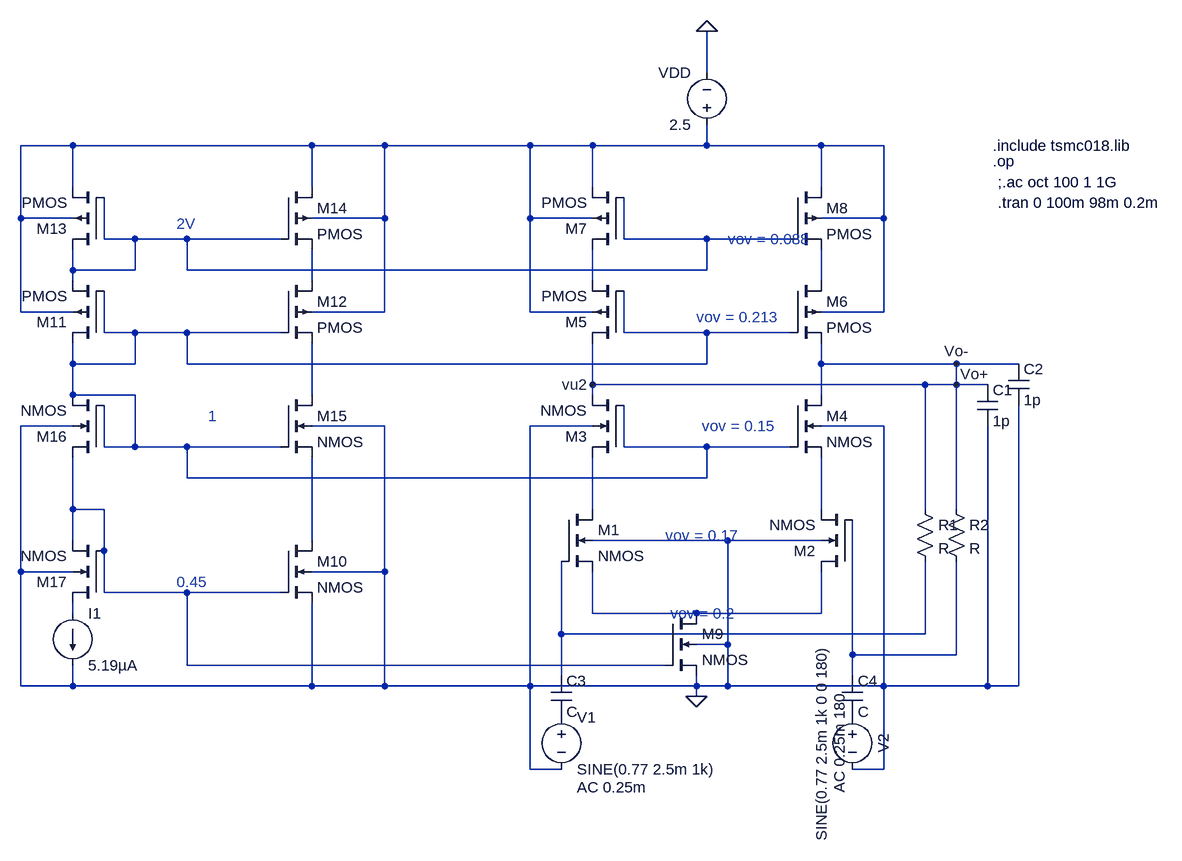
[diagram p0: schematic advdLtspice.asc]
advdLtspice.asc, the LTspice schematic file:
Version 4
SHEET 1 1448 1228
WIRE 720 32 720 -32
WIRE -256 144 -336 144
WIRE 112 144 -256 144
WIRE 224 144 112 144
WIRE 448 144 224 144
WIRE 544 144 448 144
WIRE 720 144 720 112
WIRE 720 144 544 144
WIRE 896 144 720 144
WIRE 992 144 896 144
WIRE -256 208 -256 144
WIRE 112 208 112 144
WIRE 544 208 544 144
WIRE 896 208 896 144
WIRE -336 256 -336 144
WIRE -256 256 -336 256
WIRE 224 256 224 144
WIRE 224 256 112 256
WIRE 448 256 448 144
WIRE 544 256 448 256
WIRE 992 256 992 144
WIRE 992 256 896 256
WIRE -208 288 -208 224
WIRE -160 288 -208 288
WIRE -80 288 -160 288
WIRE 64 288 -80 288
WIRE 592 288 592 224
WIRE 720 288 592 288
WIRE 848 288 720 288
WIRE -256 336 -256 304
WIRE -160 336 -160 288
WIRE -160 336 -256 336
WIRE -80 336 -80 288
WIRE 720 336 720 288
WIRE 720 336 -80 336
WIRE -256 352 -256 336
WIRE 112 352 112 304
WIRE 544 352 544 304
WIRE 896 352 896 304
WIRE -336 400 -336 256
WIRE -256 400 -336 400
WIRE 224 400 224 256
WIRE 224 400 112 400
WIRE 448 400 448 256
WIRE 544 400 448 400
WIRE 992 400 992 256
WIRE 992 400 896 400
WIRE -208 432 -208 368
WIRE -160 432 -208 432
WIRE -80 432 -160 432
WIRE 64 432 -80 432
WIRE 592 432 592 368
WIRE 720 432 592 432
WIRE 848 432 720 432
WIRE -256 480 -256 448
WIRE -160 480 -160 432
WIRE -160 480 -256 480
WIRE -80 480 -80 432
WIRE 720 480 720 432
WIRE 720 480 -80 480
WIRE 896 480 896 448
WIRE 1104 480 896 480
WIRE 1200 480 1104 480
WIRE 544 512 544 448
WIRE 1056 512 544 512
WIRE 1104 512 1104 480
WIRE 1104 512 1056 512
WIRE 1152 512 1104 512
WIRE -256 528 -256 480
WIRE -160 528 -256 528
WIRE 112 528 112 448
WIRE 544 528 544 512
WIRE 896 528 896 480
WIRE -256 576 -336 576
WIRE 224 576 112 576
WIRE 544 576 448 576
WIRE 992 576 896 576
WIRE -208 608 -208 544
WIRE -160 608 -160 528
WIRE -160 608 -208 608
WIRE -80 608 -160 608
WIRE 64 608 -80 608
WIRE 592 608 592 544
WIRE 720 608 592 608
WIRE 848 608 720 608
WIRE -80 656 -80 608
WIRE 720 656 720 608
WIRE 720 656 -80 656
WIRE -256 704 -256 624
WIRE -208 704 -256 704
WIRE 544 704 544 624
WIRE 896 704 896 624
WIRE 1056 704 1056 512
WIRE 1104 704 1104 512
WIRE -256 752 -256 704
WIRE 112 752 112 624
WIRE 752 752 544 752
WIRE 896 752 752 752
WIRE -208 768 -208 704
WIRE -336 800 -336 576
WIRE -256 800 -336 800
WIRE 224 800 224 576
WIRE 224 800 112 800
WIRE -208 832 -208 768
WIRE -80 832 -208 832
WIRE 64 832 -80 832
WIRE -256 864 -256 848
WIRE 544 864 544 800
WIRE 704 864 544 864
WIRE 896 864 896 800
WIRE 896 864 704 864
WIRE 496 896 496 784
WIRE 1056 896 1056 784
WIRE 1056 896 496 896
WIRE 752 912 752 752
WIRE 752 912 704 912
WIRE 944 928 944 720
WIRE 1104 928 1104 784
WIRE 1104 928 944 928
WIRE -80 944 -80 832
WIRE 656 944 -80 944
WIRE 496 960 496 896
WIRE 944 960 944 928
WIRE -336 976 -336 800
WIRE -256 976 -256 944
WIRE -256 976 -336 976
WIRE 112 976 112 848
WIRE 112 976 -256 976
WIRE 224 976 224 800
WIRE 224 976 112 976
WIRE 448 976 448 576
WIRE 448 976 224 976
WIRE 704 976 704 960
WIRE 704 976 448 976
WIRE 752 976 752 912
WIRE 752 976 704 976
WIRE 992 976 992 576
WIRE 992 976 752 976
WIRE 1152 976 1152 576
WIRE 1152 976 992 976
WIRE 1200 976 1200 544
WIRE 1200 976 1152 976
WIRE 704 992 704 976
WIRE 448 1104 448 976
WIRE 496 1104 448 1104
WIRE 992 1104 992 976
WIRE 992 1104 944 1104
FLAG 704 992 0
FLAG 720 -32 0
FLAG 1104 480 Vo-
FLAG 1104 512 Vo+
FLAG 544 512 vu2
SYMBOL cmosn 496 704 R0
SYMATTR InstName M1
SYMATTR Value2 l=0.35u w=1.463u
SYMATTR Value NMOS
SYMBOL cmosn 944 800 R180
SYMATTR InstName M2
SYMATTR Value2 l=0.35u w=1.463u
SYMATTR Value NMOS
SYMBOL cmosn 592 624 R180
SYMATTR InstName M3
SYMATTR Value2 l=0.35u w=10.987u
SYMATTR Value NMOS
SYMBOL cmosn 848 528 R0
SYMATTR InstName M4
SYMATTR Value2 l=0.35u w=10.987u
SYMATTR Value NMOS
SYMBOL cmosp 592 448 R180
SYMATTR InstName M5
SYMATTR Value2 l=0.35u w=12.129u
SYMATTR Value PMOS
SYMBOL cmosp 848 352 R0
SYMATTR InstName M6
SYMATTR Value2 l=0.35u w=12.129u
SYMATTR Value PMOS
SYMBOL cmosp 592 304 R180
SYMATTR InstName M7
SYMATTR Value2 l=0.35u w=0.737u
SYMATTR Value PMOS
SYMBOL cmosp 848 208 R0
SYMATTR InstName M8
SYMATTR Value2 l=0.35u w=0.737u
SYMATTR Value PMOS
SYMBOL cmosn 656 864 R0
SYMATTR InstName M9
SYMATTR Value2 l=0.35u w=3.1814u
SYMATTR Value NMOS
SYMBOL voltage 720 128 R180
WINDOW 0 24 96 Left 2
WINDOW 3 24 16 Left 2
WINDOW 123 0 0 Left 0
WINDOW 39 0 0 Left 0
SYMATTR InstName VDD
SYMATTR Value 2.5
SYMBOL voltage 496 1008 R0
WINDOW 123 24 124 Left 2
WINDOW 39 0 0 Left 0
SYMATTR Value2 AC 0.25m
SYMATTR InstName V1
SYMATTR Value SINE(0.77 2.5m 1k)
SYMBOL voltage 944 1008 R0
WINDOW 0 32 56 VTop 2
WINDOW 3 -32 56 VBottom 2
WINDOW 123 -4 56 VBottom 2
WINDOW 39 0 0 Left 0
SYMATTR InstName V2
SYMATTR Value SINE(0.77 2.5m 1k 0 0 180)
SYMATTR Value2 AC 0.25m 180
SYMBOL pmos4 -208 448 R180
SYMATTR InstName M11
SYMATTR Value2 l=0.35u w=0.35u
SYMBOL pmos4 64 352 R0
SYMATTR InstName M12
SYMATTR Value2 l=0.35u w=0.35u
SYMBOL pmos4 -208 304 R180
SYMATTR InstName M13
SYMATTR Value2 l=0.35u w=15.1289u
SYMBOL pmos4 64 208 R0
SYMATTR InstName M14
SYMATTR Value2 l=0.35u w=15.1289u
SYMBOL nmos4 64 528 R0
SYMATTR InstName M15
SYMATTR Value2 l=0.35u w=34.545u
SYMBOL nmos4 -208 624 R180
SYMATTR InstName M16
SYMATTR Value2 l=0.35u w=34.545u
SYMBOL cap 1136 512 R0
SYMATTR InstName C1
SYMATTR Value 1p
SYMBOL cap 1184 480 R0
SYMATTR InstName C2
SYMATTR Value 1p
SYMBOL nmos4 64 752 R0
SYMATTR InstName M10
SYMATTR Value2 l=0.35u w=24.93u
SYMBOL nmos4 -208 848 R180
SYMATTR InstName M17
SYMATTR Value2 l=0.35u w=24.93u
SYMBOL current -256 864 R0
WINDOW 123 0 0 Left 0
WINDOW 39 0 0 Left 0
SYMATTR InstName I1
SYMATTR Value 5.19µA
SYMBOL cap 480 960 R0
SYMATTR InstName C3
SYMBOL cap 928 960 R0
SYMATTR InstName C4
SYMBOL res 1040 688 R0
SYMATTR InstName R1
SYMBOL res 1088 688 R0
SYMATTR InstName R2
TEXT 1160 144 Left 2 !.include tsmc018.lib
TEXT 1160 168 Left 2 !.op
TEXT 1168 200 Left 2 !;.ac oct 100 1 1G
TEXT -96 816 Left 2 ;0.45
TEXT 656 744 Left 2 ;vov = 0.17
TEXT 664 864 Left 2 ;vov = 0.2
TEXT 712 576 Left 2 ;vov = 0.15
TEXT -48 560 Left 2 ;1
TEXT 704 408 Left 2 ;vov = 0.213
TEXT -96 264 Left 2 ;2V
TEXT 752 288 Left 2 ;vov = 0.088
TEXT 1168 232 Left 2 !.tran 0 100m 98m 0.2m

The netlist it stands for:
* advdLtspice.asc
M1 N009 N014 N013 0 NMOS l=0.35u w=1.463u
M2 N013 N015 N010 0 NMOS l=0.35u w=1.463u
M3 N009 N006 vu2 0 NMOS l=0.35u w=10.987u
M4 vu2 N006 N010 0 NMOS l=0.35u w=10.987u
M5 vu2 N006 N004 N001 PMOS l=0.35u w=12.129u
M6 N005 N006 vu2 N001 PMOS l=0.35u w=12.129u
M7 N004 N002 N001 N001 PMOS l=0.35u w=0.737u
M8 N001 N002 N005 N001 PMOS l=0.35u w=0.737u
M9 N013 N008 0 0 NMOS l=0.35u w=3.1814u
VDD N001 0 2.5
V1 P001 0 SINE(0.77 2.5m 1k) AC 0.25m
V2 P002 0 SINE(0.77 2.5m 1k 0 0 180) AC 0.25m 180
M11 N006 N006 N002 N001 PMOS l=0.35u w=0.35u
M12 N003 N006 N007 N001 PMOS l=0.35u w=0.35u
M13 N002 N002 N001 N001 PMOS l=0.35u w=15.1289u
M14 N001 N002 N003 N001 PMOS l=0.35u w=15.1289u
M15 N007 N006 N011 0 NMOS l=0.35u w=34.545u
M16 N008 N006 N006 0 NMOS l=0.35u w=34.545u
C1 vu2 0 1p
C2 vu2 0 1p
M10 N011 N008 0 0 NMOS l=0.35u w=24.93u
M17 N012 N008 N008 0 NMOS l=0.35u w=24.93u
I1 N012 0 5.19µA
C3 N014 P001 C
C4 N015 P002 C
R1 vu2 N014 R
R2 vu2 N015 R
.model NMOS NMOS
.model PMOS PMOS
.lib standard.mos
.include tsmc018.lib
.op
;.ac oct 100 1 1G
* 0.45
* vov = 0.17
* vov = 0.2
* vov = 0.15
* 1
* vov = 0.213
* 2V
* vov = 0.088
.tran 0 100m 98m 0.2m
.backanno
.end